# Altium schematic sheet IMU.SchDoc: Motherboard-IMU
size A4; Author: Patryk Bujak; DrawnBy: Patryk Bujak; DocumentNumber: 12; Revision: 1.0; SheetNumber: 7; SheetTotal: 10
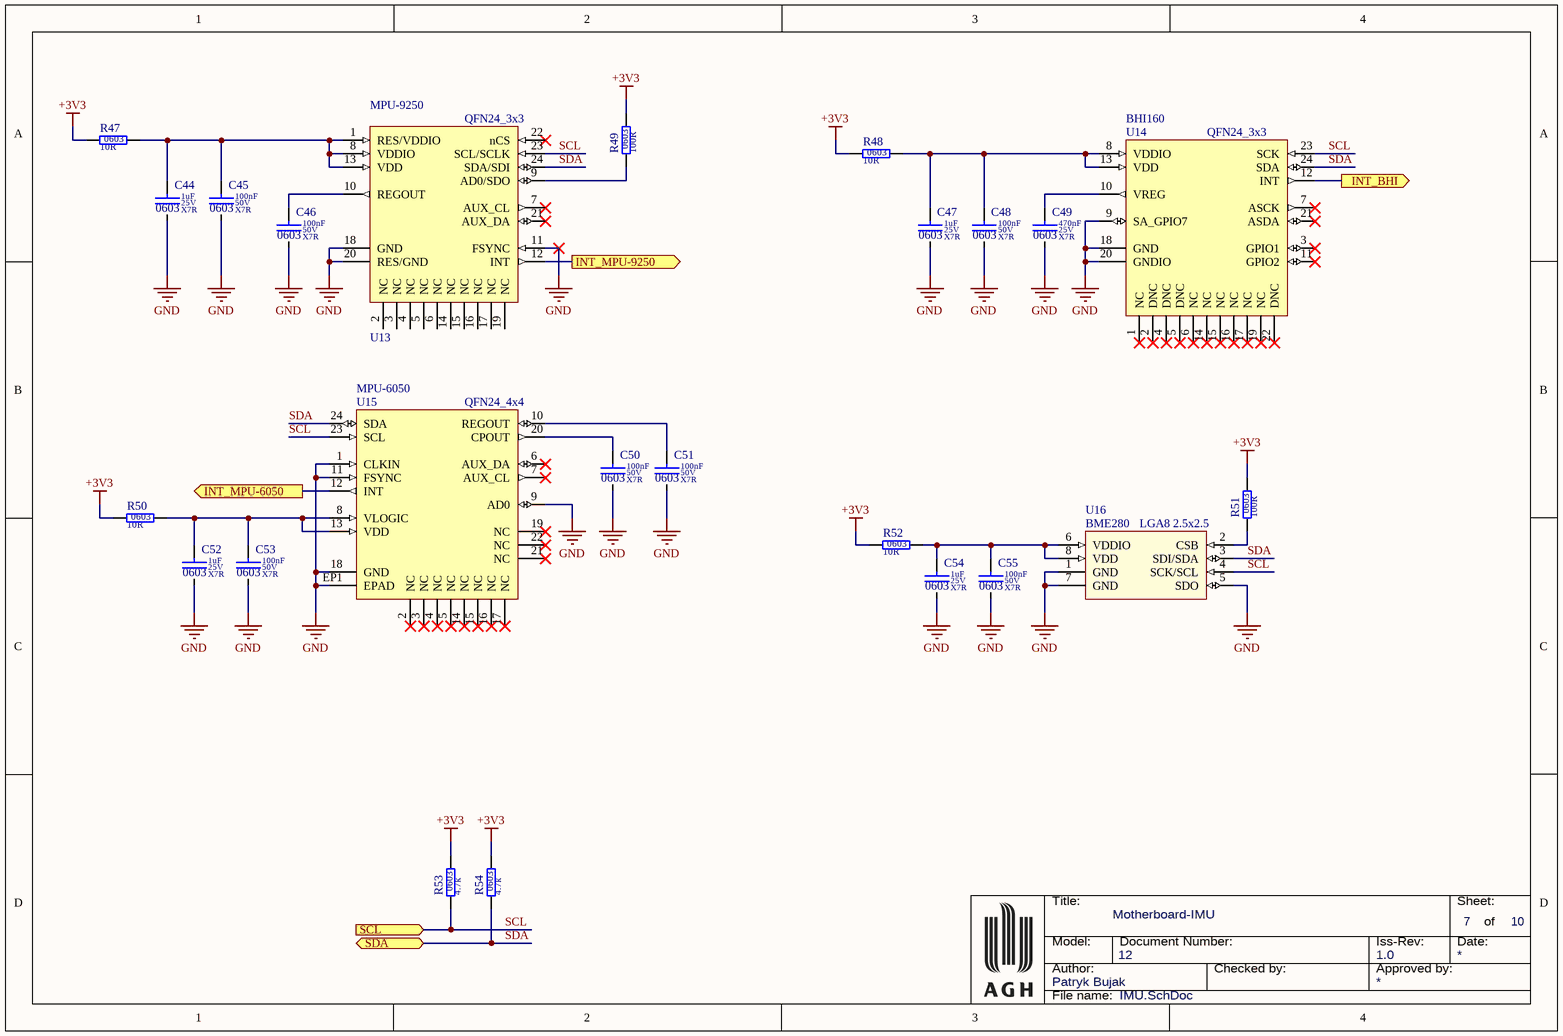
[diagram p0: IMU.SchDoc]

## Parts
C44  value 1uF  Dielectric: X7R  Voltage: 25V  SCH_Footprint: 0603  [C_0603_1608]  (hidden comment: Ceramic X7R)
C45  value 100nF  Dielectric: X7R  Voltage: 50V  SCH_Footprint: 0603  [C_0603_1608]  (hidden comment: Ceramic X7R)
C46  value 100nF  Dielectric: X7R  Voltage: 50V  SCH_Footprint: 0603  [C_0603_1608]  (hidden comment: Ceramic X7R)
C47  value 1uF  Dielectric: X7R  Voltage: 25V  SCH_Footprint: 0603  [C_0603_1608]  (hidden comment: Ceramic X7R)
C48  value 100nF  Dielectric: X7R  Voltage: 50V  SCH_Footprint: 0603  [C_0603_1608]  (hidden comment: Ceramic X7R)
C49  value 470nF  Dielectric: X7R  Voltage: 25V  SCH_Footprint: 0603  [C_0603_1608]  (hidden comment: Ceramic X7R)
C50  value 100nF  Dielectric: X7R  Voltage: 50V  SCH_Footprint: 0603  [C_0603_1608]  (hidden comment: Ceramic X7R)
C51  value 100nF  Dielectric: X7R  Voltage: 50V  SCH_Footprint: 0603  [C_0603_1608]  (hidden comment: Ceramic X7R)
C52  value 1uF  Dielectric: X7R  Voltage: 25V  SCH_Footprint: 0603  [C_0603_1608]  (hidden comment: Ceramic X7R)
C53  value 100nF  Dielectric: X7R  Voltage: 50V  SCH_Footprint: 0603  [C_0603_1608]  (hidden comment: Ceramic X7R)
C54  value 1uF  Dielectric: X7R  Voltage: 25V  SCH_Footprint: 0603  [C_0603_1608]  (hidden comment: Ceramic X7R)
C55  value 100nF  Dielectric: X7R  Voltage: 50V  SCH_Footprint: 0603  [C_0603_1608]  (hidden comment: Ceramic X7R)
R47  value 10R  SCH_Footprint: 0603  [R_0603_1608]  (hidden comment: Resistor)
R48  value 10R  SCH_Footprint: 0603  [R_0603_1608]  (hidden comment: Resistor)
R49  value 100R  SCH_Footprint: 0603  [R_0603_1608]  (hidden comment: Resistor)
R50  value 10R  SCH_Footprint: 0603  [R_0603_1608]  (hidden comment: Resistor)
R51  value 100R  SCH_Footprint: 0603  [R_0603_1608]  (hidden comment: Resistor)
R52  value 10R  SCH_Footprint: 0603  [R_0603_1608]  (hidden comment: Resistor)
R53  value 4.7k  SCH_Footprint: 0603  [R_0603_1608]  (hidden comment: Resistor)
R54  value 4.7k  SCH_Footprint: 0603  [R_0603_1608]  (hidden comment: Resistor)
U13  value MPU-9250  [QFN24_3x3]  (hidden comment: Nine-Axis (Gyro + Accelerometer + Compass) MEMS MotionTracking Device)
U14  value BHI160  [QFN24_3x3]  (hidden comment: Three Axis Ultra Low Power Sensor Hub - LGA-24)
U15  value MPU-6050  [QFN24_4x4]  (hidden comment: Accelerometer and Gyroscope Digital Output 2.5V/3.3V 24-Pin QFN EP)
U16  value BME280  SCH_Footprint: LGA8 2.5x2.5  [LGA8_2.5x2.5]  (hidden comment: Combined humidity and pressure sensor)

## Ports
INT_BHI (out), INT_MPU-6050 (out), INT_MPU-9250 (out), SCL (in), SDA (bidir)

## Nets
+3V3: R47.1 R48.1 R49.2 R50.1 R51.2 R52.1 R53.2 R54.2
GND: C44.2 C45.2 C46.2 C47.2 C48.2 C49.2 C50.2 C51.2 C52.2 C53.2 C54.2 C55.2 U13.11(FSYNC) U13.18(GND) U13.20(RES/GND) U14.9(SA_GPIO7) U14.18(GND) U14.20(GNDIO) U15.1(CLKIN) U15.9(AD0) U15.11(FSYNC) U15.18(GND) U15.EP1(EPAD) U16.1(GND) U16.5(SDO) U16.7(GND)
INT_BHI: U14.12(INT) ; port INT_BHI
INT_MPU-6050: U15.12(INT) ; port INT_MPU-6050
INT_MPU-9250: U13.12(INT) ; port INT_MPU-9250
SCL: R53.1 U13.23(SCL/SCLK) U14.23(SCK) U15.23(SCL) U16.4(SCK/SCL) ; port SCL
SDA: R54.1 U13.24(SDA/SDI) U14.24(SDA) U15.24(SDA) U16.3(SDI/SDA) ; port SDA
NetC44_1: C44.1 C45.1 R47.2 U13.1(RES/VDDIO) U13.8(VDDIO) U13.13(VDD)
NetC46_1: C46.1 U13.10(REGOUT)
NetC47_1: C47.1 C48.1 R48.2 U14.8(VDDIO) U14.13(VDD)
NetC49_1: C49.1 U14.10(VREG)
NetC50_1: C50.1 U15.20(CPOUT)
NetC51_1: C51.1 U15.10(REGOUT)
NetC52_1: C52.1 C53.1 R50.2 U15.8(VLOGIC) U15.13(VDD)
NetC54_1: C54.1 C55.1 R52.2 U16.6(VDDIO) U16.8(VDD)
NetR49_1: R49.1 U13.9(AD0/SDO)
NetR51_1: R51.1 U16.2(CSB)

Not connected (* = marked no-connect by the designer): U13 2(NC) 3(NC) 4(NC) 5(NC) 6(NC) 7(AUX_CL)* 14(NC) 15(NC) 16(NC) 17(NC) 19(NC) 21(AUX_DA)* 22(nCS)*; U14 1(NC)* 2(DNC)* 3(GPIO1)* 4(DNC)* 5(DNC)* 6(NC)* 7(ASCK)* 11(GPIO2)* 14(NC)* 15(NC)* 16(NC)* 17(NC)* 19(NC)* 21(ASDA)* 22(DNC)*; U15 2(NC)* 3(NC)* 4(NC)* 5(NC)* 6(AUX_DA)* 7(AUX_CL)* 14(NC)* 15(NC)* 16(NC)* 17(NC)* 19(NC)* 21(NC)* 22(NC)*

## Notes on the sheet
- Title:
- Sheet:
- of
- Author:
- Model:
- Document Number:
- Checked by:
- Iss-Rev:
- Approved by:
- Date:
- File name:

## Library data of the parts
C44 C47 C52 C54 = C_1uF_25V_X7R_0603_10: Capacitor; Manufacturer: Samsung; Manufacturer Part Number: CL10B105KA8NNNC; Tolerance (%): 10; Part Number: C_1uF_25V_X7R_0603_10; HelpURL: http://www.tme.eu/pl/Document/4a42202b32dab16128fe107dd69598cc/samsung-chip-cap.pdf; Supplier 1: TME; Supplier Part Number 1: CL10B105KA8NNNC; Supplier 2: RS Components; Supplier 3: Farnell; Supplier 4: Mouser; Supplier 5: Digi-Key
C45 C46 C48 C50 C51 C53 C55 = C_100nF_50V_X7R_0603_5: Capacitor; Manufacturer: Samsung; Manufacturer Part Number: CL10B104JB8NNNC; Tolerance (%): 5; Part Number: C_100nF_50V_X7R_0603_5; HelpURL: http://www.tme.eu/pl/Document/4a42202b32dab16128fe107dd69598cc/samsung-chip-cap.pdf; Supplier 1: TME; Supplier Part Number 1: CL10B104JB8NNNC; Supplier 2: RS Components; Supplier 3: Farnell; Supplier 4: Mouser; Supplier 5: Digi-Key
C49 = C_470nF_25V_X7R_0603_10: Capacitor; Manufacturer: Murata; Manufacturer Part Number: GRM188R71E474KA12D; Tolerance (%): 10; Part Number: C_470nF_25V_X7R_0603_10; HelpURL: http://www.farnell.com/datasheets/2048708.pdf; Supplier 1: TME; Supplier 2: RS Components; Supplier Part Number 2: 7235654; Supplier 3: Farnell; Supplier Part Number 3: 1828901; Supplier 4: Mouser; Supplier Part Number 4: 81-GRM188R71E474KA12; Supplier 5: Digi-Key; Supplier Part Number 5: 490-3291-1-ND
R47 R48 R50 R52 = R_10R_0603_1: Manufacturer: Royalohm; Manufacturer Part Number: 0603SAF100JT5E; Voltage: 50V; Power: 100mW; Tolerance: 1%; Part Number: R_10R_0603_1; HelpURL: http://www.tme.eu/pl/Document/b315665a56acbc42df513c99b390ad98/ROYALOHM-THICKFILM.pdf; Supplier 1: TME; Supplier Part Number 1: SMD0603-10R-1%; Supplier 2: RS Components; Supplier 3: Farnell; Supplier 4: Mouser; Supplier 5: Digi-Key
R49 R51 = R_100R_0603_1: Manufacturer: Yageo; Manufacturer Part Number: RC0603FR-07100RL; Voltage: 50V; Power: 100mW; Tolerance: 1%; Part Number: R_100R_0603_1; HelpURL: http://www.tme.eu/en/Document/d2a72e545e5c8eb7bf2a04fa97535928/rc0603yageo.pdf; Supplier 1: TME; Supplier Part Number 1: RC0603FR-07100R; Supplier 2: RS Components; Supplier 3: Farnell; Supplier Part Number 3: 2131804; Supplier 4: Mouser; Supplier Part Number 4: 603-RC0603FR-07100RL; Supplier 5: Digi-Key; Supplier Part Number 5: 311-100HRCT-ND
R53 R54 = R_4.7k_0603_1: Manufacturer: Yageo; Manufacturer Part Number: RC0603FR-074K7L; Voltage: 75V; Power: 100mW; Tolerance: 1%; Part Number: R_4.7k_0603_1; HelpURL: http://www.farnell.com/datasheets/2167052.pdf?_ga=2.156163131.1690599162.1548417389-1379097396.1542296996&_gac=1.18389067.1547230258.Cj0KCQiAmuHhBRD0ARIsAFWyPwhX8HcvXnM3tA0ZBodZLzDIjH2ZxLpjT5LWo9bad_HPRbU8LfPq44UaAhEwEALw_wcB; Supplier 1: TME; Supplier Part Number 1: RC0603FR-074K7; Supplier 2: RS Components; Supplier 3: Farnell; Supplier Part Number 3: 9238565; Supplier 4: Mouser; Supplier Part Number 4: 603-RC0603FR-074K7L; Supplier 5: Digi-Key; Supplier Part Number 5: 311-4.70KHRCT-ND
U13 = U_MPU-9250: Manufacturer: InvenSense; SCH_Footprint: QFN24_3x3; Part Number: U_MPU-9250; HelpURL: https://datasheet.octopart.com/MPU-9250-InvenSense-datasheet-21859386.pdf; Manufacturer Part Number: MPU-9250; Supplier 1: TME; Supplier 2: RS Components; Supplier 3: Farnell; Supplier 4: Mouser; Supplier Part Number 4: 410-MPU-9250; Supplier 5: Digi-Key; Supplier Part Number 5: 1428-1019-1-ND
U14 = U_BHI160: Manufacturer: Bosch Tools; SCH_Footprint: QFN24_3x3; Part Number: U_BHI160; HelpURL: https://datasheet.octopart.com/BHI160-Bosch-datasheet-66132459.pdf; Manufacturer Part Number: BHI160; Supplier 1: TME; Supplier 2: RS Components; Supplier 3: Farnell; Supplier 4: Mouser; Supplier Part Number 4: 262-BHI160; Supplier 5: Digi-Key; Supplier Part Number 5: 828-1067-1-ND
U15 = U_MPU-6050: Manufacturer: InvenSense; SCH_Footprint: QFN24_4x4; Part Number: U_MPU-6050; HelpURL: https://datasheet.octopart.com/MPU-6050-InvenSense-datasheet-21631037.pdf; Manufacturer Part Number: MPU-6050; Supplier 1: TME; Supplier 2: RS Components; Supplier Part Number 2: 8837948; Supplier 3: Farnell; Supplier Part Number 3: 1864742; Supplier 4: Mouser; Supplier Part Number 4: 410-MPU-6050; Supplier 5: Digi-Key; Supplier Part Number 5: 1428-1007-1-ND
U16 = U_BME280: Manufacturer: Bosch Tools; Part Number: U_BME280; HelpURL: https://cdn-shop.adafruit.com/datasheets/BST-BME280_DS001-10.pdf; Manufacturer Part Number: BME280; Supplier 1: TME; Supplier 2: RS Components; Supplier 3: Farnell; Supplier 4: Mouser; Supplier Part Number 4: 262-BME280; Supplier 5: Digi-Key; Supplier Part Number 5: 828-1063-1-ND